# EAGLE design avr-dds-signal-generator-mod (EAGLE 7.7.0)
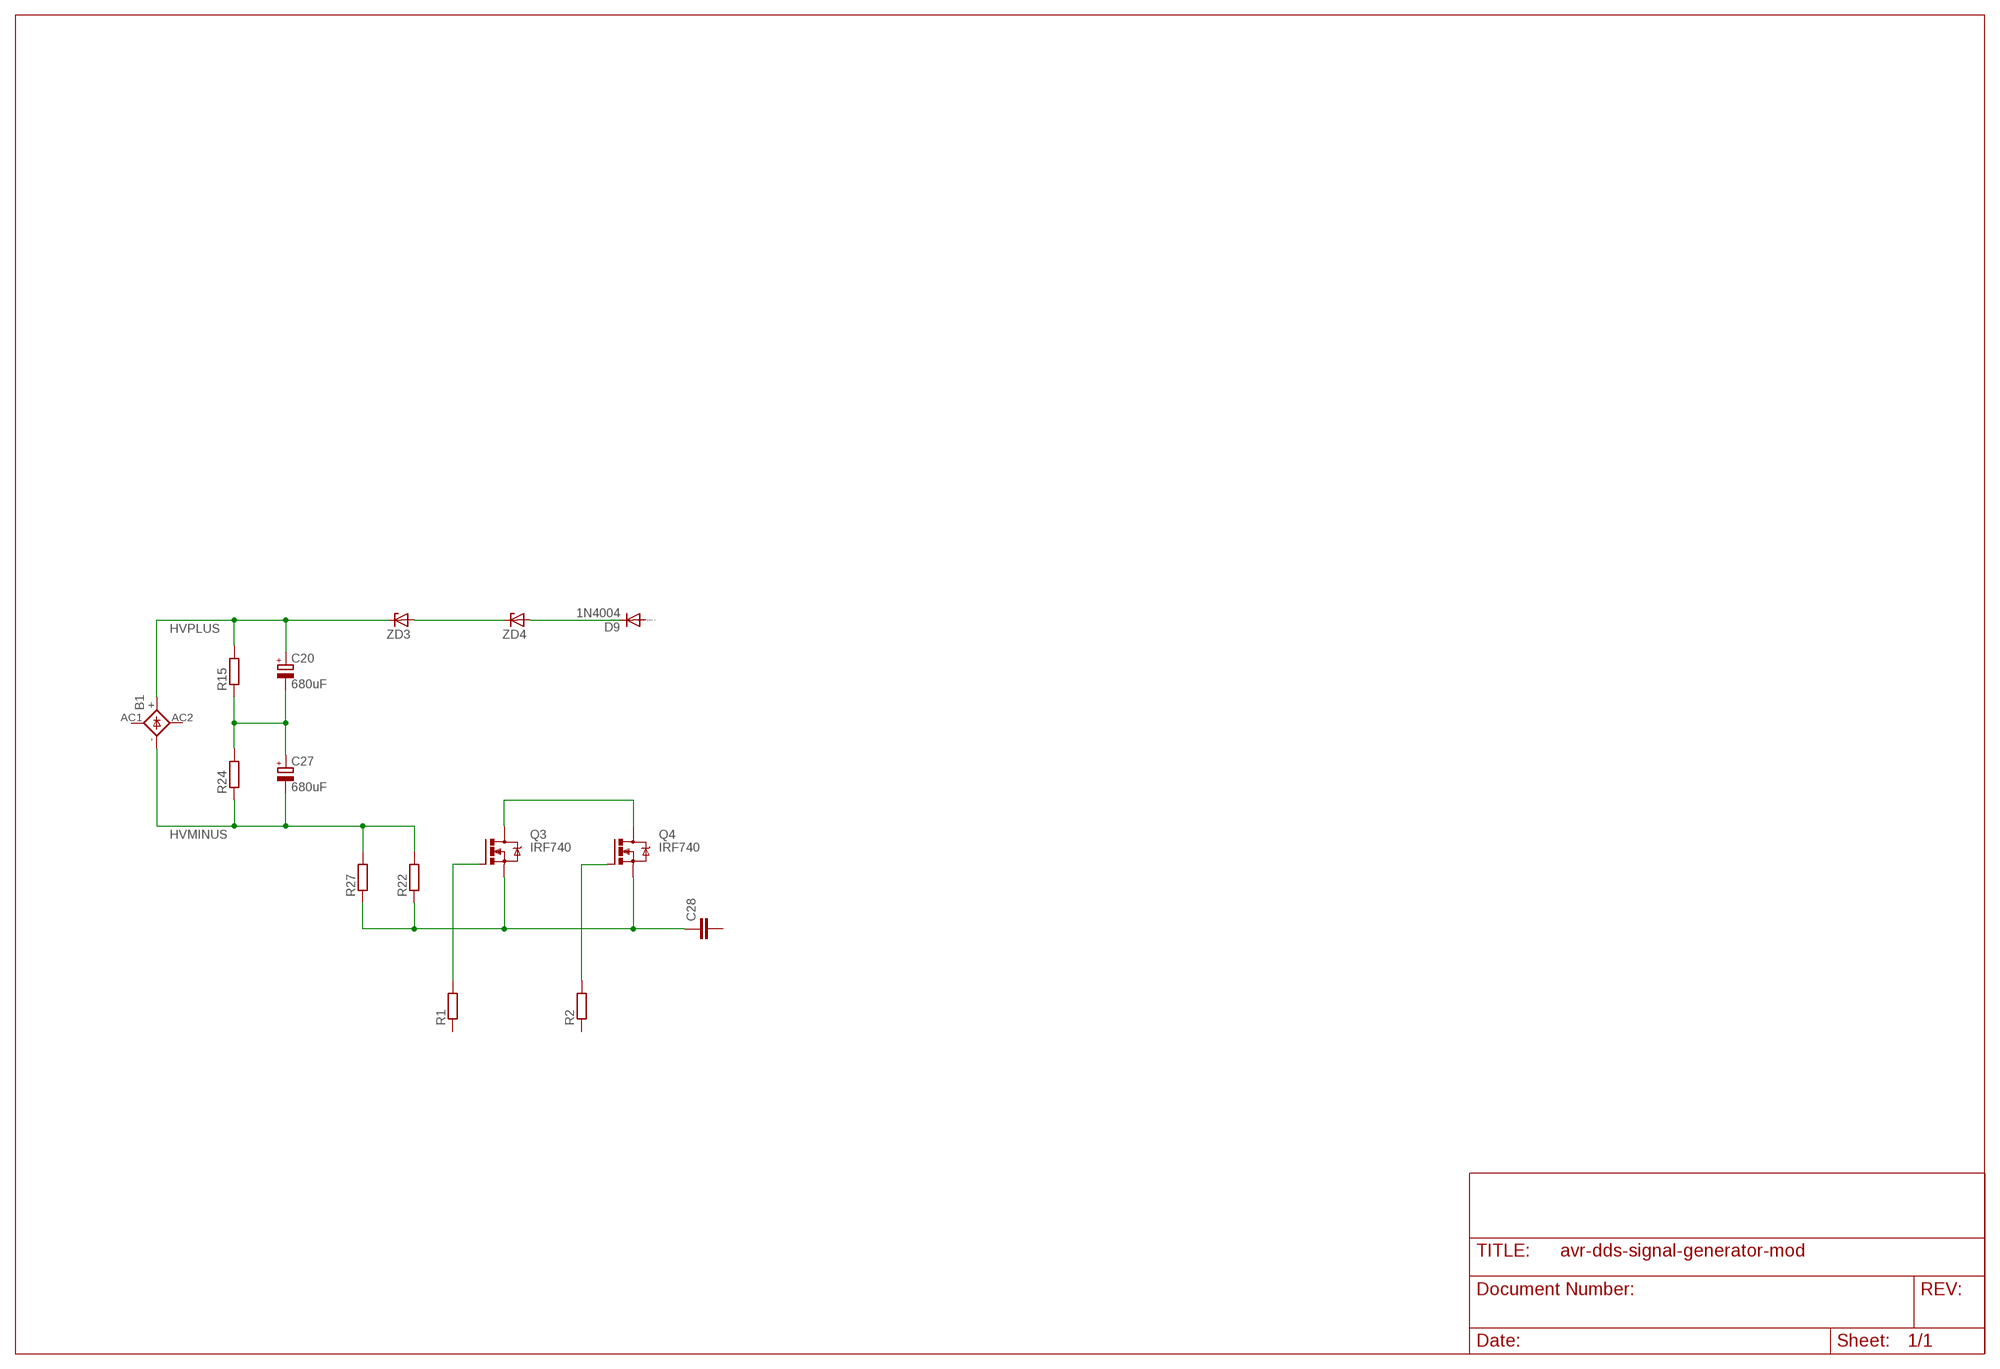
[diagram p0: schematic, sheet 1]

## Parts
B1  KBU  [KBU]
C20  680uF  CPOL-EUE10-22.5  [EB22,5D]
C27  680uF  CPOL-EUE10-22.5  [EB22,5D]
C28  C-EU025-025X050  [C025-025X050]
D9  1N4004  [DO41-10]
Q3  IRF740  [TO220BV]
Q4  IRF740  [TO220BV]
R1  R-EU_0309/12  [0309/12]
R2  R-EU_0309/12  [0309/12]
R15  R-EU_0309/12  [0309/12]
R22  R-EU_0414/15  [0414/15]
R24  R-EU_0309/12  [0309/12]
R27  R-EU_0414/15  [0414/15]
ZD3  ZENER-DIODEC1702-15  [C1702-15]
ZD4  ZENER-DIODEC1702-15  [C1702-15]

## Nets
HVMINUS: B1.- C27.- R22.2 R24.1 R27.2
HVPLUS: B1.+ C20.+ R15.2 ZD3.C
N$1: ZD3.A ZD4.C
N$2: C20.- C27.+ R15.1 R24.2
N$3: D9.C ZD4.A
N$4: C28.1 Q3.S Q4.S R22.1 R27.1
N$5: Q3.D Q4.D
N$6: Q3.G R1.2
N$7: Q4.G R2.2
Unconnected: B1.AC1 B1.AC2 C28.2 D9.A R1.1 R2.1

## Library data of the parts
B1 = rectifier:KBU: DIOTEC RECTIFIER
C20 C27 = rcl:CPOL-EU: POLARIZED CAPACITOR, European symbol
C28 = resistor:C-EU: CAPACITOR, European symbol
D9 = diode:1N4004: DIODE general purpose rectifier, 1 A
Q3 Q4 = transistor-power:IRF740: N-CHANNEL MOS FET
R1 R2 R15 R24 = rcl:R-EU_: RESISTOR, European symbol
R22 R27 = resistor:R-EU_: RESISTOR, European symbol
ZD3 ZD4 = diode:ZENER-DIODE: Z-Diode

## Board
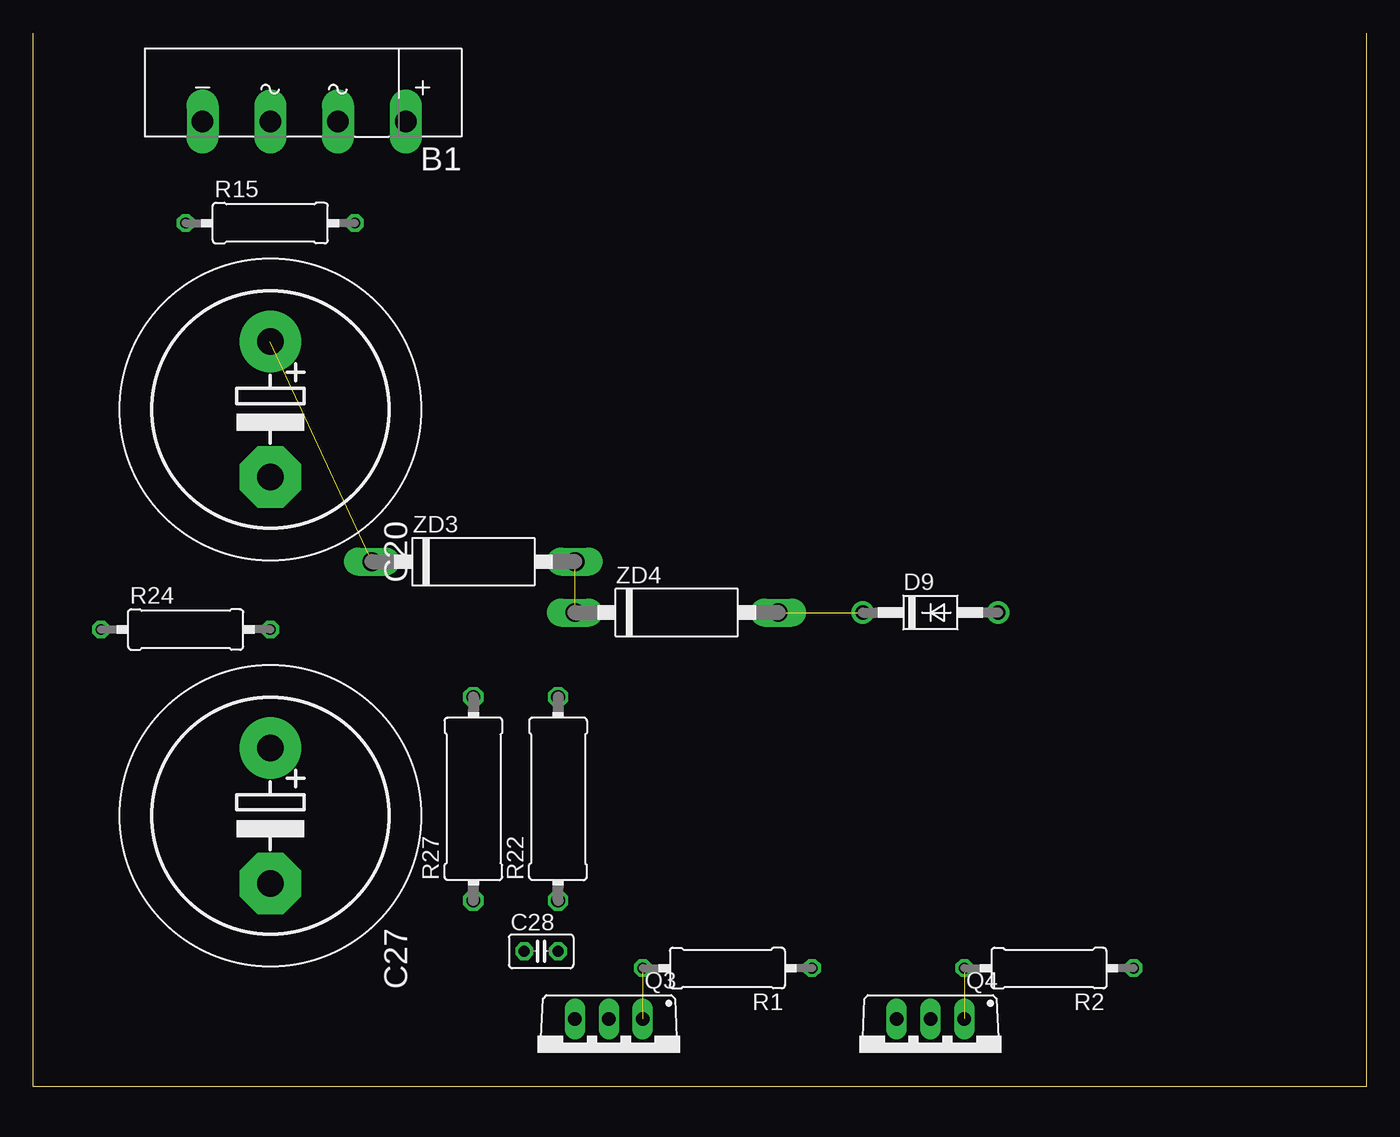
[diagram p1: board, top side]
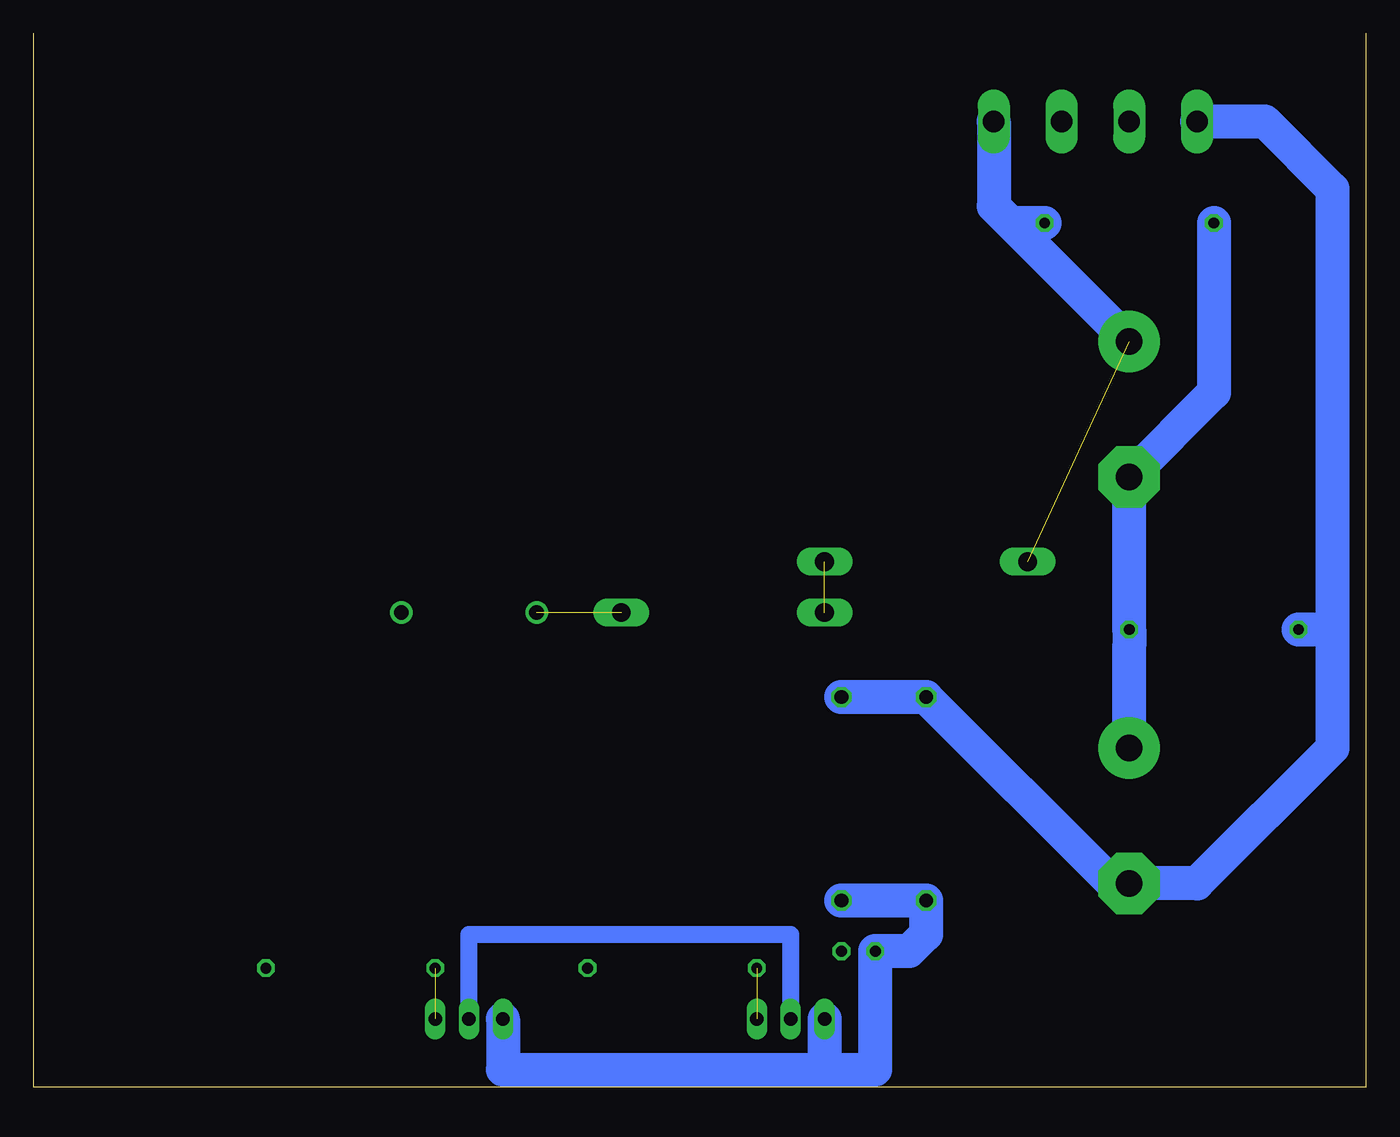
[diagram p2: board, bottom side, seen from below]

Size 100 x 79 mm. Coordinates in mm from the lower left corner, seen from the top.
Outline: 100,79 100,0 0,0 0,79
Copper layers (1*16): Top 0.035mm / dielectric 1.5mm / Bottom 0.035mm
Design rules "OLIMEX_10mils": minimum track width 10mil, minimum drill 24mil, track to track 10mil, track to pad 10mil, pad to pad 10mil, via to via 10mil, smd to smd 10mil, copper to edge 40mil, drill to drill 10mil, minimum pad ring 10mil, minimum via ring 8mil, stop-mask expansion 0mil, vias tented up to drill 0mil, thermal gap 10mil

### Footprints (pad centres in the part's own frame; a part is rotated, then mirrored left to right if it is on the bottom)
KBU = drill 1.6 long: + -7.62,2.54; - 7.62,2.54; AC1 -2.54,2.54; AC2 2.54,2.54
EB22,5D = drill 2.007 pad 4.597: + -5.08,0 | drill 2.007 pad 4.597 octagon: - 5.08,0
C025-025X050 = drill 0.813 octagon: 1 -1.27,0; 2 1.27,0
DO41-10 = drill 1.118: A 5.08,0; C -5.08,0
TO220BV = drill 1.016 long: D 0,-2.54; G -2.54,-2.54; S 2.54,-2.54
0309/12 = drill 0.813 octagon: 1 -6.35,0; 2 6.35,0
0414/15 = drill 1.016 octagon: 1 -7.62,0; 2 7.62,0
C1702-15 = drill 1.397 long: A 7.62,0; C -7.62,0

### Placement (x,y rotation side)
B1  20.32,74.93 180 top
C20  17.78,50.8 270 top
C27  17.78,20.32 270 top
C28  38.1,10.16 0 top
D9  67.31,35.56 0 top
Q3  43.18,2.54 180 top
Q4  67.31,2.54 180 top
R1  52.07,8.89 180 top
R2  76.2,8.89 180 top
R15  17.78,64.77 0 top
R22  39.37,21.59 90 top
R24  11.43,34.29 0 top
R27  33.02,21.59 90 top
ZD3  33.02,39.37 0 top
ZD4  48.26,35.56 0 top

### Tracks (layer width: path | path; a pad name or v marks a point on that pad's centre or on a via)
HVMINUS
  Bottom 2.54: B1.- 7.62,72.39 2.54,67.31 2.54,34.29 | 2.54,34.29 2.54,25.4 12.7,15.24 C27.- 19.05,15.24 R27.2 R22.2 | R24.1 2.54,34.29
HVPLUS  (1 unrouted)
  Bottom 2.54: B1.+ 27.94,66.04 26.67,64.77 | 26.67,64.77 C20.+ | R15.2 26.67,64.77
N$1  (1 unrouted)
N$2
  Bottom 2.54: C27.+ 17.78,33.02 R24.2 C20.- 11.43,52.07 R15.1
N$3  (1 unrouted)
N$4
  Bottom 2.54: Q3.S 40.64,1.27 | 40.64,1.27 36.83,1.27 C28.1 34.29,10.16 33.02,11.43 R27.1 R22.1 | Q4.S 64.77,1.27 40.64,1.27
N$5
  Bottom 1.27: Q4.D 67.31,11.43 43.18,11.43 Q3.D
N$6  (1 unrouted)
N$7  (1 unrouted)